# EAGLE design controller (EAGLE 9.2.0)
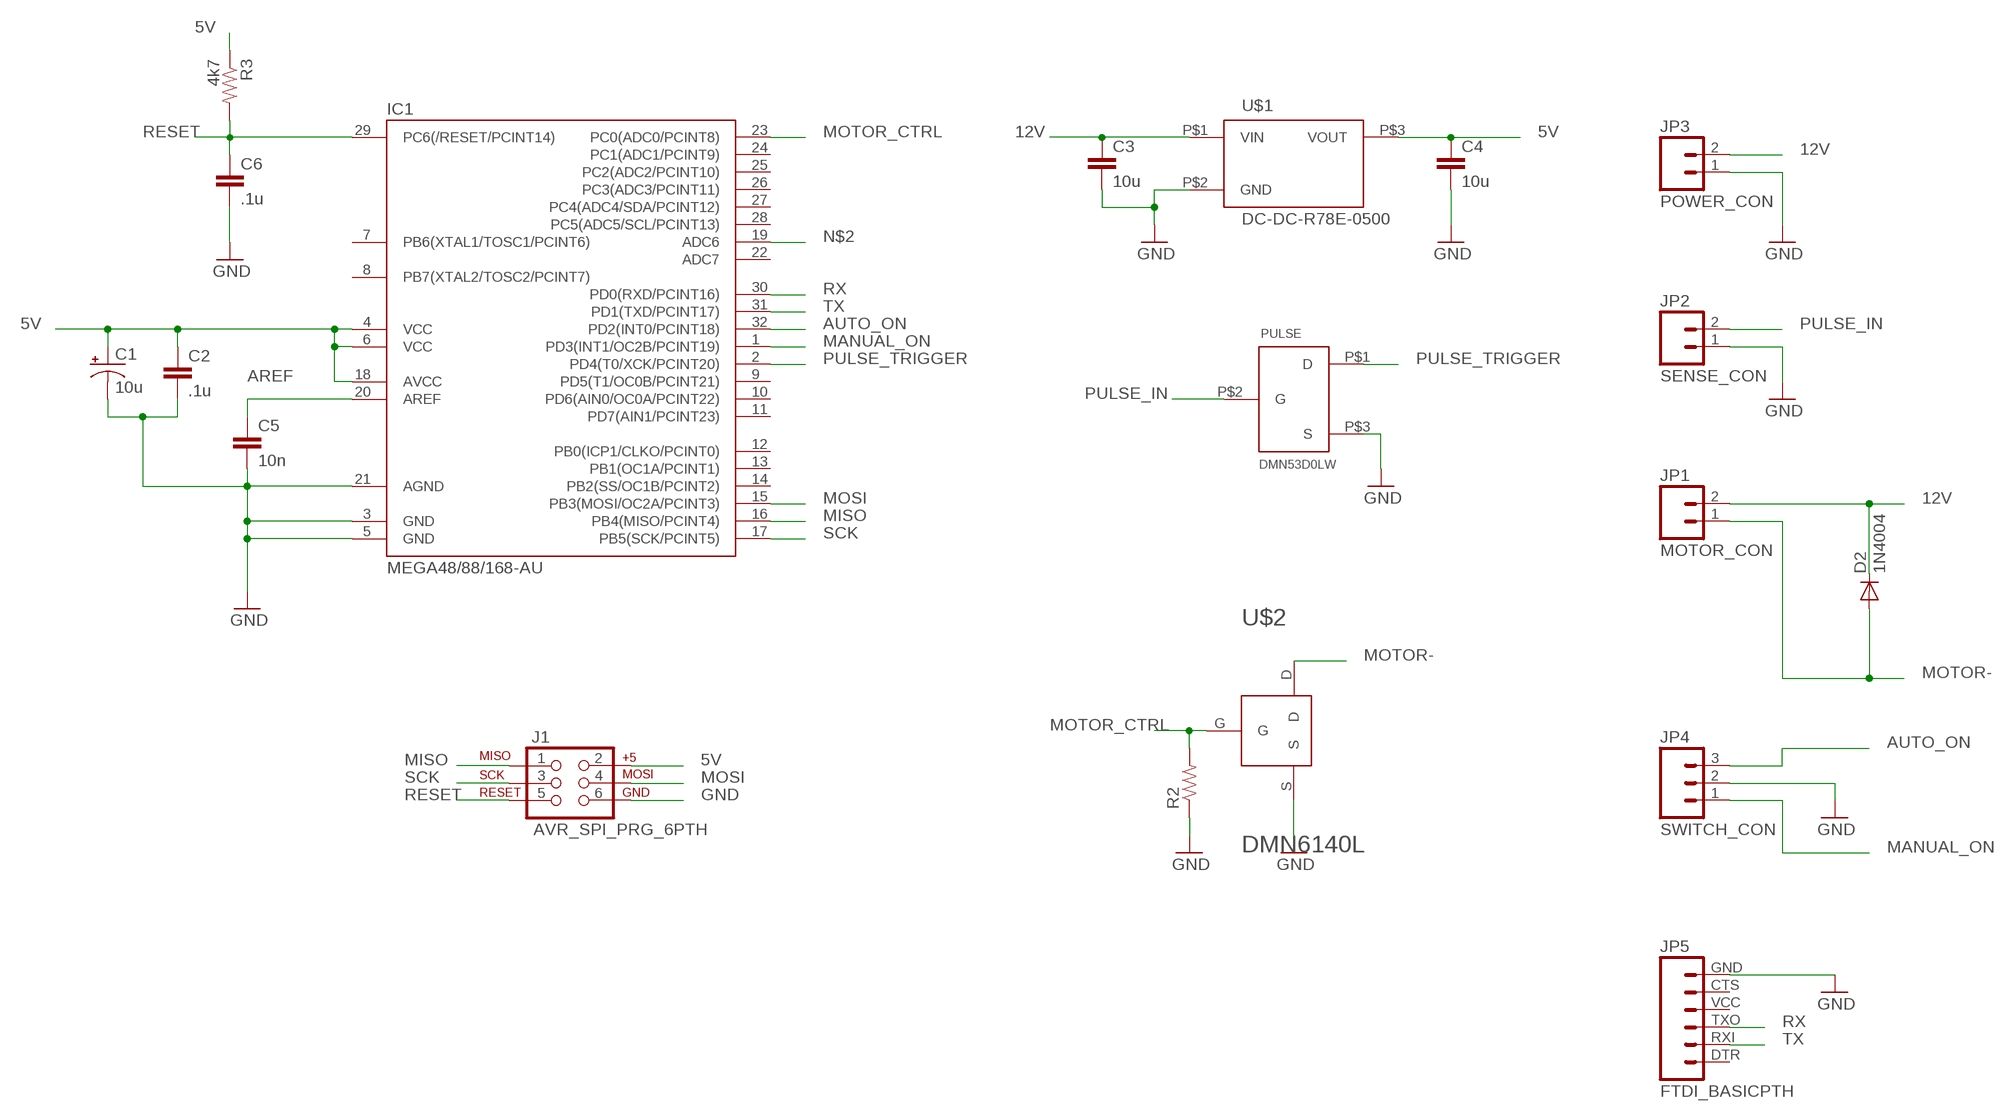
[diagram p0: schematic, sheet 1]

## Parts
C1  10u  CAP_POL1206  [EIA3216]
C2  .1u  CAP0805  [0805]
C3  10u  CAP0805  [0805]
C4  10u  CAP0805  [0805]
C5  10n  CAP0805  [0805]
C6  .1u  CAP0805  [0805]
D2  1N4004  [DO41-10]
IC1  MEGA48/88/168-AU  [TQFP32-08]
J1  AVR_SPI_PRG_6PTH  [2X3]
JP1  MOTOR_CON  M02  [1X02_LONGPADS]
JP2  SENSE_CON  M02  [1X02_LONGPADS]
JP3  POWER_CON  M02  [1X02_LONGPADS]
JP4  SWITCH_CON  M031X03_NO_SILK  [1X03_NO_SILK]
JP5  FTDI_BASICPTH  [FTDI_BASIC]
PULSE  DMN53D0LW  [SOT-323]
R2  RESISTOR1206  [1206]
R3  4k7  RESISTOR1206  [1206]
U$1  DC-DC-R78E-0500  [DC-DC-R78E-0500]
U$2  DMN6140L  [SOT-32-DIODES]

## Nets
5V: C1.A(+) C2.1 C4.1 IC1.4(VCC) IC1.6(VCC) IC1.18(AVCC) J1.2 R3.1 U$1.P$3(VOUT)
12V: C3.1 D2.C JP1.2 JP3.2 U$1.P$1(VIN)
AREF: C5.1 IC1.20(AREF)
AUTO_ON: IC1.32(PD2(INT0/PCINT18)) JP4.3
GND: C1.C(-) C2.2 C3.2 C4.2 C5.2 C6.2 IC1.3(GND) IC1.5(GND) IC1.21(AGND) J1.6 JP2.1 JP3.1 JP4.2 JP5.GND PULSE.P$3(S) R2.1 U$1.P$2(GND) U$2.S
MANUAL_ON: IC1.1(PD3(INT1/OC2B/PCINT19)) JP4.1
MISO: IC1.16(PB4(MISO/PCINT4)) J1.1
MOSI: IC1.15(PB3(MOSI/OC2A/PCINT3)) J1.4
MOTOR-: D2.A JP1.1 U$2.D
MOTOR_CTRL: IC1.23(PC0(ADC0/PCINT8)) R2.2 U$2.G
N$2: IC1.19(ADC6)
PULSE_IN: JP2.2 PULSE.P$2(G)
PULSE_TRIGGER: IC1.2(PD4(T0/XCK/PCINT20)) PULSE.P$1(D)
RESET: C6.1 IC1.29(PC6(/RESET/PCINT14)) J1.5 R3.2
RX: IC1.30(PD0(RXD/PCINT16)) JP5.TXO
SCK: IC1.17(PB5(SCK/PCINT5)) J1.3
TX: IC1.31(PD1(TXD/PCINT17)) JP5.RXI
Unconnected: IC1.7(PB6(XTAL1/TOSC1/PCINT6)) IC1.8(PB7(XTAL2/TOSC2/PCINT7)) IC1.9(PD5(T1/OC0B/PCINT21)) IC1.10(PD6(AIN0/OC0A/PCINT22)) IC1.11(PD7(AIN1/PCINT23)) IC1.12(PB0(ICP1/CLKO/PCINT0)) IC1.13(PB1(OC1A/PCINT1)) IC1.14(PB2(SS/OC1B/PCINT2)) IC1.22(ADC7) IC1.24(PC1(ADC1/PCINT9)) IC1.25(PC2(ADC2/PCINT10)) IC1.26(PC3(ADC3/PCINT11)) IC1.27(PC4(ADC4/SDA/PCINT12)) IC1.28(PC5(ADC5/SCL/PCINT13)) JP5.CTS JP5.DTR JP5.VCC

## Library data of the parts
C1 = SparkFun:CAP_POL: Capacitor Polarized These are standard SMD and PTH capacitors. Normally 10uF, 47uF, and 100uF in electrolytic and tantalum varieties. Always verify the external diameter of the through hole cap, it varies with capacity, voltage, and manufacturer. The EIA devices should be standard.
C2-C6 = SparkFun:CAP: Capacitor Standard 0603 ceramic capacitor, and 0.1" leaded capacitor.
D2 = diode:1N4004: DIODE general purpose rectifier, 1 A
IC1 = avr-7:MEGA48/88/168
J1 = SparkFun-Connectors:AVR_SPI_PRG_6: AVR ISP 6 Pin This is the reduced ISP connector for AVR programming. Common on Arduino. This footprint will take up less PCB space and can be used with a 10-pin to 6-pin adapter such as SKU: BOB-08508
JP1-JP3 = SparkFun:M02: Header 2 Standard 2-pin 0.1" header. Use with straight break away headers (SKU : PRT-00116), right angle break away headers (PRT-00553), swiss pins (PRT-00743), machine pins (PRT-00117), and female headers (PRT-00115). Molex polarized connector foot print use with SKU : PRT-08233 with associated crimp pins and housings.
JP4 = SparkFun:M03: Header 3 Standard 3-pin 0.1" header. Use with straight break away headers (SKU : PRT-00116), right angle break away headers (PRT-00553), swiss pins (PRT-00743), machine pins (PRT-00117), and female headers (PRT-00115). Molex polarized connector foot print use with SKU : PRT-08232 with associated crimp pins and housings.
JP5 = SparkFun-Connectors:FTDI_BASIC: FTDI Basic header with labels
PULSE = GARTH:DMN53D0LW
R2 R3 = SparkFun:RESISTOR: Resistor Basic schematic elements and footprints for 0603, 1206, and PTH 1/10th watt (small) resistors.
U$1 = GARTH:DC-DC-R78E-0500: The R-78E series is a switching regulator module that has been designed to offer all the advantages of a switching regulator (high efficiency, wide input range, accurate output voltage regulation)
U$2 = GARTH:DMN6140L

## Board
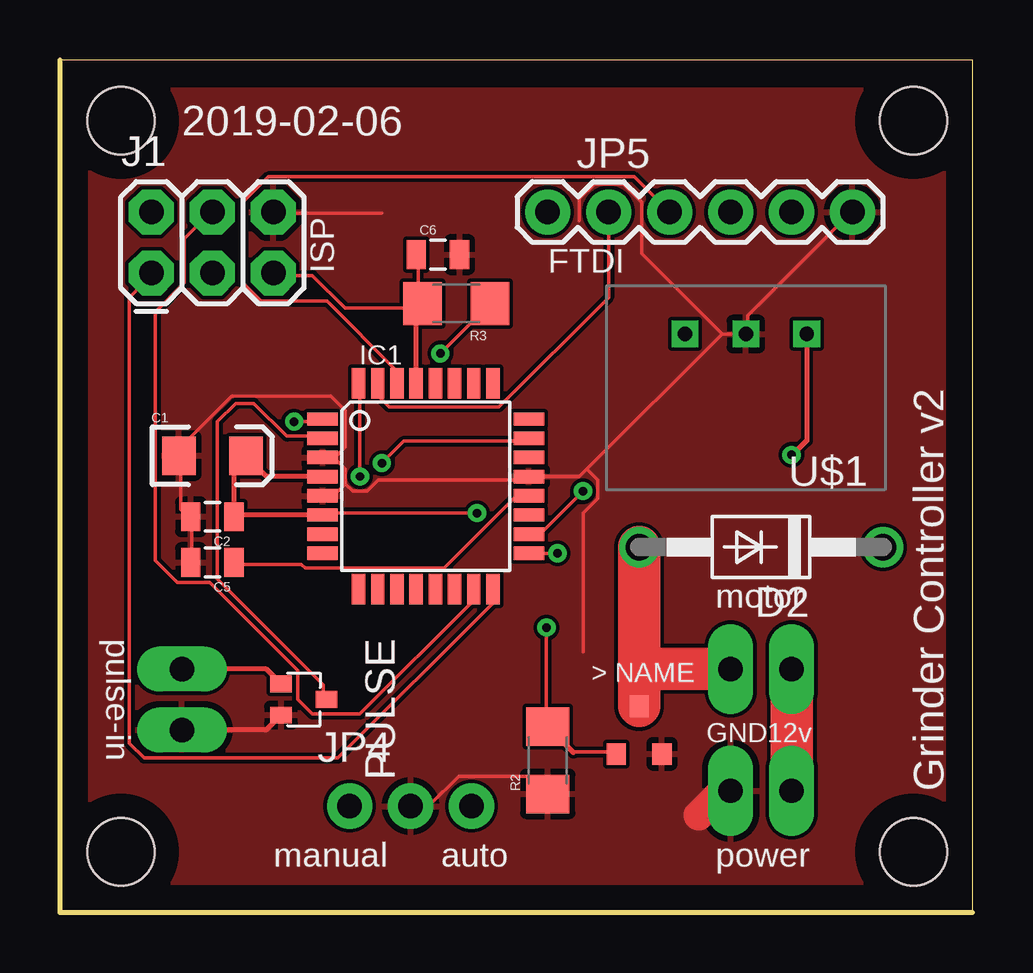
[diagram p1: board, top side]
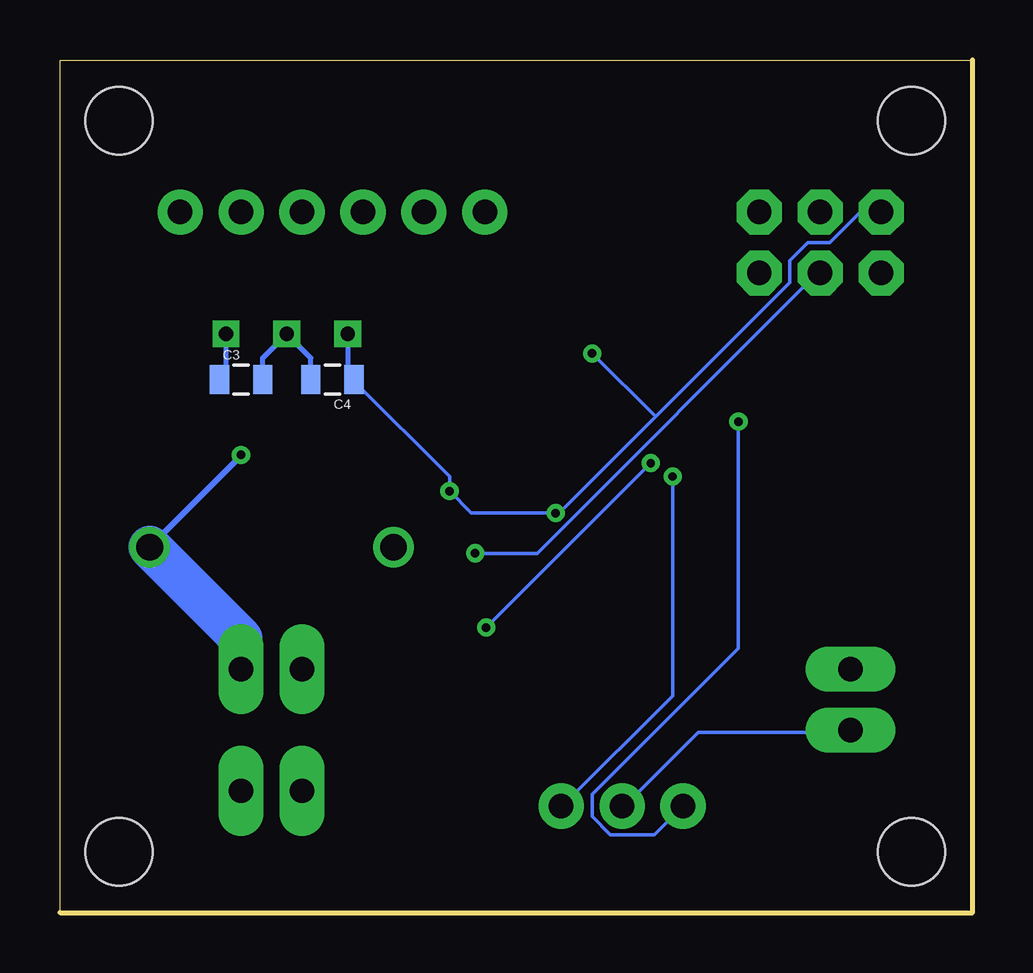
[diagram p2: board, bottom side, seen from below]

Size 38.02 x 35.55 mm. Coordinates in mm from the lower left corner, seen from the top.
Outline: 38.02,0 38.02,35.55 0,35.55 0,0 38.02,0
Copper layers (1*16): Top 0.035mm / dielectric 1.5mm / Bottom 0.035mm
Design rules "default": minimum track width 6mil, minimum drill 0.35mm, track to track 6mil, track to pad 6mil, pad to pad 6mil, via to via 6mil, smd to smd 6mil, copper to edge 40mil, drill to drill 6mil, minimum pad ring 10mil, minimum via ring 8mil, stop-mask expansion 4mil, vias tented up to drill 0mil, thermal gap 10mil
Holes 2.8 mm at 2.54,2.54 35.56,2.54 35.56,33.02 2.54,33.02

### Footprints (pad centres in the part's own frame; a part is rotated, then mirrored left to right if it is on the bottom)
EIA3216 = smd 1.4 x 1.6: A 1.4,0; C -1.4,0
0805 = smd 0.8 x 1.2: 1 -0.9,0; 2 0.9,0
DO41-10 = drill 1.118: A 5.08,0; C -5.08,0
TQFP32-08 = smd 1.27 x 0.559: 1 -4.293,2.8; 2 -4.293,2; 3 -4.293,1.2; 4 -4.293,0.4; 5 -4.293,-0.4; 6 -4.293,-1.2; 7 -4.293,-2; 8 -4.293,-2.8; 17 4.293,-2.8; 18 4.293,-2; 19 4.293,-1.2; 20 4.293,-0.4; 21 4.293,0.4; 22 4.293,1.2; 23 4.293,2; 24 4.293,2.8 | smd 0.559 x 1.27: 9 -2.8,-4.293; 10 -2,-4.293; 11 -1.2,-4.293; 12 -0.4,-4.293; 13 0.4,-4.293; 14 1.2,-4.293; 15 2,-4.293; 16 2.8,-4.293; 25 2.8,4.293; 26 2,4.293; 27 1.2,4.293; 28 0.4,4.293; 29 -0.4,4.293; 30 -1.2,4.293; 31 -2,4.293; 32 -2.8,4.293
2X3 = drill 1.016 pad 1.88 octagon: 1 0,0; 2 0,2.54; 3 2.54,0; 4 2.54,2.54; 5 5.08,0; 6 5.08,2.54
1X02_LONGPADS = drill 1.016 pad 1.88 long: 1 0,0; 2 2.54,0
1X03_NO_SILK = drill 1.016 pad 1.88: 1 0,0; 2 2.54,0; 3 5.08,0
FTDI_BASIC = drill 1.016 pad 1.88: CTS 10.16,0; DTR 0,0; GND 12.7,0; RXI 2.54,0; TXO 5.08,0; VCC 7.62,0
SOT-323 = smd 0.7 x 0.9: P$1 0,0.95; P$2 -0.65,-0.95; P$3 0.65,-0.95
1206 = smd 1.6 x 1.8: 1 -1.4,0; 2 1.4,0
DC-DC-R78E-0500 = drill 0.6 square: P$1 -2.54,0; P$2 0,0; P$3 2.54,0
SOT-32-DIODES = smd 0.8 x 0.9: D 0,1; G -0.95,-1; S 0.95,-1

### Placement (x,y rotation side)
C1  6.35,19.05 0 top
C2  6.35,16.51 180 top
C3  30.48,22.23 0 bottom
C4  26.67,22.23 180 bottom
C5  6.35,14.61 180 top
C6  15.75,27.43 0 top
D2  29.21,15.24 180 top
IC1  15.24,17.78 0 top
J1  3.81,26.67 0 top
JP1  27.94,10.16 0 top
JP2  5.08,7.62 90 top
JP3  27.94,5.08 0 top
JP4  12.06,4.45 0 top
JP5  20.32,29.21 0 top
PULSE  10.16,8.89 270 top
R2  20.32,6.35 90 top
R3  16.51,25.4 180 top
U$1  28.57,24.13 180 top
U$2  24.13,7.62 0 top

### Tracks (layer width: path | path; a pad name or v marks a point on that pad's centre or on a via)
5V  (via drill 0.35)
  Top 0.152: v21.79,17.58 20.12,15.9 19.66,15.9 IC1.18 | v17.37,16.66 10.97,16.66 IC1.6 | v15.85,23.32 17.83,25.3 R3.1
  Top 0.203: IC1.4 8.62,18.18 C1.A 7.25,18.55 C2.1 7.32,16.58 IC1.6
  Bottom 0.152: C4.1 25.76,22.15 21.79,18.19 v21.79,17.58 20.88,16.66 v17.37,16.66 17.22,16.66 13.21,20.68 | 13.21,20.68 7.62,26.26 7.62,27.18 6.86,27.94 5.94,27.94 4.72,29.16 3.81,29.16 J1.2 | 13.21,20.68 v15.85,23.32
  Bottom 0.203: U$1.P$3 26.04,22.49 C4.1
12V  (via drill 0.35)
  Top 0.203: U$1.P$1 31.11,19.68 30.48,19.05 v30.48,19.09
  Top 1.778: JP1.2 JP3.2
  Bottom 0.203: U$1.P$1 31.11,22.49 C3.1
  Bottom 0.254: D2.C 30.48,19.05 v30.48,19.09
  Bottom 1.778: D2.C 30.48,11.43 JP1.2
AREF
  Top 0.152: C5.1 7.32,14.53 10.06,14.53 10.21,14.38 16,14.38 18.9,17.27 19.51,17.27 IC1.20
AUTO_ON  (via drill 0.35)
  Top 0.152: v12.5,18.19 12.5,22 IC1.32
  Bottom 0.152: v12.5,18.19 12.5,9.04 17.07,4.47 JP4.3
GND
  Top 0.152: JP4.2 14.63,4.47 15.39,4.47 16.61,5.69 19.66,5.69 20.27,5.08 R2.1 | 13.41,29.16 8.99,29.16 J1.6 | JP5.GND 32.92,29.16 28.65,24.89 28.65,24.13 U$1.P$2 27.58,24.13 | C5.2 5.49,14.68 5.49,16.51 C2.2 5.33,16.51 5.03,16.82 5.03,18.95 C1.C 5.03,19.1 5.03,19.41 7.16,21.54 11.28,21.54 11.89,20.93 11.89,19.41 11.43,18.95 | 11.89,17.88 11.43,17.42 10.97,17.42 IC1.5 | 11.89,17.88 11.89,18.49 11.43,18.95 | 11.43,18.95 10.97,18.95 IC1.3 11.43,18.95 | 11.89,17.88 12.19,17.58 12.8,17.58 13.26,18.03 19.51,18.03 IC1.21 19.66,18.19 21.64,18.19 21.95,18.49 | 21.95,18.49 27.58,24.13 | 21.64,28.85 21.64,29.77 22.25,30.38 23.47,30.38 24.23,29.62 24.23,27.48 27.58,24.13 | 21.79,10.87 21.79,16.66 22.4,17.27 22.4,18.03 21.95,18.49
  Top 0.203: PULSE.P$3 8.59,7.62 JP2.1
  Top 1.27: JP3.1 27.64,5.08 26.62,4.06
  Bottom 0.152: JP2.1 5.18,7.52 11.43,7.52 14.48,4.47 JP4.2
  Bottom 0.203: C4.2 27.57,23.12 U$1.P$2 29.58,23.12 C3.2
  pour Top: 1.27,34.29 1.27,1.27 36.83,1.27 36.83,34.29
MANUAL_ON  (via drill 0.35)
  Top 0.152: v9.75,20.47 10.82,20.47 IC1.1
  Bottom 0.152: v9.75,20.47 9.75,11.02 15.85,4.93 15.85,4.01 15.09,3.25 13.26,3.25 JP4.1
MISO
  Top 0.152: IC1.16 17.98,13.46 17.98,12.85 11.58,6.45 3.5,6.45 2.9,7.06 2.9,25.65 3.81,26.57 J1.1
MOSI
  Top 0.152: IC1.15 17.22,13.46 17.22,13.01 12.5,8.28 10.52,8.28 9.91,8.89 9.91,10.11 6.25,13.77 4.88,13.77 3.96,14.68 3.96,25.04 5.18,26.26 5.18,28.09 6.25,29.16 J1.4
MOTOR-
  Top 1.778: U$2.D 24.13,10.16 | 24.13,10.16 D2.A | JP1.1 24.13,10.16
MOTOR_CTRL  (via drill 0.35)
  Top 0.152: v13.41,18.75 14.33,19.66 19.51,19.66 IC1.23 | v20.27,11.89 20.27,7.77 R2.2 | U$2.G 23.16,6.71 21.49,6.71 21.4,6.67
  Top 0.203: 21.4,6.67 R2.2
  Bottom 0.152: v20.27,11.89 v13.41,18.75
PULSE_IN
  Top 0.203: PULSE.P$2 8.59,10.16 JP2.2
PULSE_TRIGGER
  Top 0.152: PULSE.P$1 10.97,8.89 10.97,9.5 6.55,13.92 6.55,20.47 7.32,21.23 8.08,21.23 9.45,19.86 10.82,19.86 IC1.2
RESET
  Top 0.152: J1.5 8.99,26.57 10.52,26.57 11.89,25.2 14.78,25.2 R3.2 14.94,25.3 14.94,27.43 C6.1
  Top 0.203: IC1.29 14.84,25.13 R3.2
RX
  Top 0.152: JP5.TXO 23.93,30.68 8.69,30.68 7.62,29.62 7.62,26.26 8.38,25.5 11.12,25.5 14.02,22.61 14.02,22.15 IC1.30
SCK  (via drill 0.35)
  Top 0.152: v20.73,14.99 19.66,14.99 IC1.17
  Bottom 0.152: v20.73,14.99 18.14,14.99 6.4,26.72 J1.3
TX
  Top 0.152: JP5.RXI 22.86,25.65 18.29,21.08 13.72,21.08 13.26,21.54 13.26,22 IC1.31

### Text on the board
tPlace: 2019-02-06 | ISP | FTDI | motor | pulse-in | GND | 12v | Grinder Controller v2 | manual | auto | power